# Altium schematic sheet MCU.SchDoc: MCU
size A
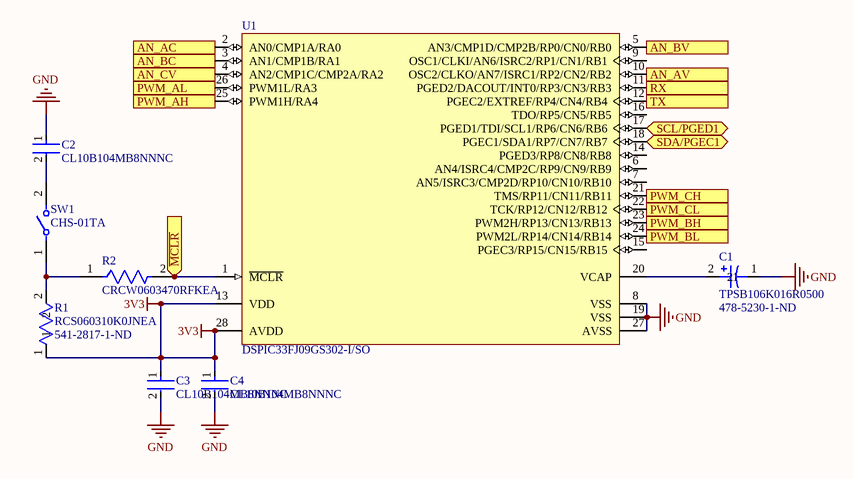
[diagram p0: MCU.SchDoc]

## Parts
C1  TPSB106K016R0500  Supplier Part Number 1: 478-5230-1-ND  [TPSB106K016R0500]
C2  CL10B104MB8NNNC  [FP-CL10-IPC_C]
C3  CL10B104MB8NNNC  [FP-CL10-IPC_C]
C4  CL10B104MB8NNNC  [FP-CL10-IPC_C]
R1  RCS060310K0JNEA  Supplier Part Number 1: 541-2817-1-ND  [RCS060310K0JNEA]
R2  CRCW0603470RFKEA  [FP-CRCW0603-e3-MFG]
SW1  CHS-01TA  [FP-CHS-01TA-MFG]
U1  DSPIC33FJ09GS302-I/SO  [MCHP-SOIC-SO28_M]

## Ports
AN_AC (in), AN_AV (in), AN_BC (in), AN_BV (in), AN_CV (in), PWM_AH (out), PWM_AL (out), PWM_BH (out), PWM_BL (out), PWM_CH (out), PWM_CL (out), RX (in), SCL/PGED1 (bidir), SDA/PGEC1 (bidir), TX (out), ~{MCLR} (in)

## Nets
3V3: C3.1 C4.1 R1.1 U1.13(VDD) U1.28(AVDD)
GND: C1.1 C2.1 C3.2 C4.2 U1.8(VSS) U1.19(VSS) U1.27(AVSS)
AN_AC: U1.2(AN0/CMP1A/RA0) ; port AN_AC
AN_AV: U1.10(OSC2/CLKO/AN7/ISRC1/RP2/CN2/RB2) ; port AN_AV
AN_BC: U1.3(AN1/CMP1B/RA1) ; port AN_BC
AN_BV: U1.5(AN3/CMP1D/CMP2B/RP0/CN0/RB0) ; port AN_BV
AN_CV: U1.4(AN2/CMP1C/CMP2A/RA2) ; port AN_CV
~{MCLR}: R2.2 U1.1(~{MCLR}) ; port ~{MCLR}
PWM_AH: U1.25(PWM1H/RA4) ; port PWM_AH
PWM_AL: U1.26(PWM1L/RA3) ; port PWM_AL
PWM_BH: U1.23(PWM2H/RP13/CN13/RB13) ; port PWM_BH
PWM_BL: U1.24(PWM2L/RP14/CN14/RB14) ; port PWM_BL
PWM_CH: U1.21(TMS/RP11/CN11/RB11) ; port PWM_CH
PWM_CL: U1.22(TCK/RP12/CN12/RB12) ; port PWM_CL
RX: U1.11(PGED2/DACOUT/INT0/RP3/CN3/RB3) ; port RX
SCL/PGED1: U1.17(PGED1/TDI/SCL1/RP6/CN6/RB6) ; port SCL/PGED1
SDA/PGEC1: U1.18(PGEC1/SDA1/RP7/CN7/RB7) ; port SDA/PGEC1
TX: U1.12(PGEC2/EXTREF/RP4/CN4/RB4) ; port TX
NetC1_2: C1.2 U1.20(VCAP)
NetC2_2: C2.2 SW1.2
NetR1_2: R1.2 R2.1 SW1.1

Not connected (* = marked no-connect by the designer): U1 6(AN4/ISRC4/CMP2C/RP9/CN9/RB9) 7(AN5/ISRC3/CMP2D/RP10/CN10/RB10) 9(OSC1/CLKI/AN6/ISRC2/RP1/CN1/RB1) 14(PGED3/RP8/CN8/RB8) 15(PGEC3/RP15/CN15/RB15) 16(TDO/RP5/CN5/RB5)

## Notes on the sheet
- Title
- Size:
- Date:
- A
- Number:
- Time:
- Revision:
- Sheet
- of
- File:

## Library data of the parts
C1 = TPSB106K016R0500: CAP TANT 10UF 10% 16V SMD; Manufacturer: Kyocera AVX; Dielectric Material: Tantalum; ESR (Equivalent Series Resistance): 500mR; Leakage Current: 1.6uA; Polarity: Polar; Dissipation Factor: 6%; Supplier 1: Digi-Key; Manufacturer Part Number: TPSB106K016R0500; RoHS: Yes; Category: Tantalum Capacitors; Stock 1: 4; Pricing 1: 1=0.45000, 10=0.31900, 50=0.24140, 100=0.21030, 500=0.15580, 1000=0.13243 (USD); Mount: Surface Mount,PCB; Case/Package: 1210; Case Code (Metric): 3528; Case Code (Imperial): 1210; Min Operating Temperature: -55°C; Max Operating Temperature: 125°C; Capacitance: 10uF; Tolerance: 10%; Packaging: Tape and Reel; Package Quantity: 1; Voltage Rating: 16V; Voltage Rating (DC): 16V; Features: General Purpose; Termination: SMD/SMT; Voltage: 16V; Length: 3.5mm; Width: 0.11inch; Height: 1.9mm; Depth: 2.8mm; Height - Seated (Max): 0.083inch; Radiation Hardening: No; REACH SVHC: No SVHC; Lead Free: Lead Free; ComponentLink1URL: https://datasheet.ciiva.com/11793/0900766b80e0c35e-11793349.pdf?src-supplier=RSComponents; ComponentLink1Description: https://datasheet.ciiva.com/11793/0900766b80e0c35e-11793349.pdf?src-supplier=RSComponents; ComponentLink2URL: https://datasheet.ciiva.com/264/tps-264229.pdf?src-supplier=Digi-Key; ComponentLink2Description: https://datasheet.ciiva.com/264/tps-264229.pdf?src-supplier=Digi-Key; ComponentLink3URL: https://datasheet.ciiva.com/7730/1441576-7730869.pdf?src-supplier=Element14; ComponentLink3Description: https://datasheet.ciiva.com/7730/1441576-7730869.pdf?src-supplier=Element14; ComponentLink4URL: https://datasheet.ciiva.com/17339/tps-17339429.pdf?src-supplier=Avnet+Europe; ComponentLink4Description: https://datasheet.ciiva.com/17339/tps-17339429.pdf?src-supplier=Avnet+Europe; ComponentLink5URL: https://datasheet.ciiva.com/264/tps-264230.pdf?src-supplier=Digi-Key; ComponentLink5Description: https://datasheet.ciiva.com/264/tps-264230.pdf?src-supplier=Digi-Key; ComponentLink6URL: https://datasheet.ciiva.com/7730/1680477-7730870.pdf?src-supplier=Element14; ComponentLink6Description: https://datasheet.ciiva.com/7730/1680477-7730870.pdf?src-supplier=Element14; ComponentLink7URL: https://datasheet.ciiva.com/16500/tps-16500230.pdf?src-supplier=Future+Electronics; ComponentLink7Description: https://datasheet.ciiva.com/16500/tps-16500230.pdf?src-supplier=Future+Electronics; ComponentLink8URL: https://datasheet.ciiva.com/264/tps-264231.pdf?src-supplier=Digi-Key; ComponentLink8Description: https://datasheet.ciiva.com/264/tps-264231.pdf?src-supplier=Digi-Key; ComponentLink9URL: https://datasheet.ciiva.com/7730/1441576-7730871.pdf?src-supplier=Element14; ComponentLink9Description: https://datasheet.ciiva.com/7730/1441576-7730871.pdf?src-supplier=Element14; ComponentLink10URL: https://datasheet.ciiva.com/12882/tps-23028-12882919.pdf?src-supplier=Mouser; ComponentLink10Description: https://datasheet.ciiva.com/12882/tps-23028-12882919.pdf?src-supplier=Mouser; ComponentLink11URL: https://datasheet.ciiva.com/28609/packmark-28609112.pdf?src-supplier=Element14; ComponentLink11Description: https://datasheet.ciiva.com/28609/packmark-28609112.pdf?src-supplier=Element14; ComponentLink12URL: https://datasheet.ciiva.com/14599/70001047-14599898.pdf?src-supplier=Allied+Electronics; ComponentLink12Description: https://datasheet.ciiva.com/14599/70001047-14599898.pdf?src-supplier=Allied+Electronics; ComponentLink13URL: https://datasheet.ciiva.com/14605/70001047-14605902.pdf?src-supplier=Allied+Electronics; ComponentLink13Description: https://datasheet.ciiva.com/14605/70001047-14605902.pdf?src-supplier=Allied+Electronics
C2-C4 = CMP-13271-001724-1: Cap Ceramic 100nF 50V X7R ±20% Pad SMD 0603 +125°C T/R; Mount: Surface Mount; Lead Free: Lead Free; Max Operating Temperature: 125°C; Voltage Rating: 50V; Case Code (Imperial): 0603; Capacitance: 100nF; Height: 0.8mm; Length: 1.6mm; Tolerance: 20%; Case Code (Metric): 1608; Thickness: 0.035inch; Depth: 0.8mm; Width: 0.031inch; Package Quantity: 1; Min Operating Temperature: -55°C; Case/Package: 0603; Radiation Hardening: No; Voltage Rating (DC): 50V; Dielectric: X7R; Packaging: Tape and Reel
R1 = RCS060310K0JNEA: RES SMD 10K OHM 5% 1/4W 0603; Manufacturer: Vishay Dale; Max Power Dissipation: 250mW; Temperature Coefficient: 200ppm/°C; Resistance: 10kR; Supplier 1: Digi-Key; Manufacturer Part Number: RCS060310K0JNEA; RoHS: Yes; Category: Chip SMD Resistors; Stock 1: 1896; Pricing 1: 1=0.14000, 10=0.12900, 100=0.04950, 1000=0.02178, 2500=0.01881 (USD); Case/Package: 0603; Case Code (Imperial): 0603; Case Code (Metric): 1608; Min Operating Temperature: -55°C; Max Operating Temperature: 155°C; Tolerance: 5%; Features: Automotive AEC-Q200; Packaging: Tape and Reel; Resistor Type: Thick Film; Number of Terminations: 2; Length: 0.061inch; Width: 0.033inch; Height: 0.02inch; ComponentLink1URL: http://www.vishay.com/docs/20065/rcse3.pdf?src-supplier=Digi-Key; ComponentLink1Description: http://www.vishay.com/docs/20065/rcse3.pdf?src-supplier=Digi-Key
R2 = CMP-2000-03373-2: RES Thick Film, 470Ω, 1%, 0.1W, 100ppm/°C, 0603; Voltage Rating: 75V; Resistance: 470R; Max Power Dissipation: 100mW; Lead Free: Lead Free; Weight: 7.1E-05oz; Composition: Thick Film; Case Code (Imperial): 0603; Height: 0.45mm; Width: 0.033inch; Case/Package: 0603; Package Quantity: 10; Temperature Coefficient: 100ppm/°C; Min Operating Temperature: -55°C; Case Code (Metric): 1608; Radiation Hardening: No; Mount: Surface Mount; Tolerance: 1%; Depth: 0.85mm; Power Rating: 100mW; Length: 1.55mm; Voltage Rating (DC): 75V; Number of Terminations: 2; Contact Plating: Tin; Packaging: Tape and Reel; Termination: SMD/SMT; Features: Automotive AEC-Q200; Max Operating Temperature: 155°C; Military Standard: Not
SW1 = CMP-71740-000003-1: SWITCH SLIDE DIP SPST 100MA 6V; Manufacturer: Nidec Copal Electronics; Contact Resistance: 50mΩ; Standoff Height: 0mm; Number Of Circuits: 1; Electromechanical Life: 2000Cycles; Device Class L1: Electromechanical; Device Class L2: Switches; Category: Switch; Temperature Range Low: -40°C; Device Class L3: DIP Switches; Height: 2.5mm; Lead Free: Yes; Octopart: https://octopart.com/chs-01ta-nidec+copal-52304644; Throw Configuration: SPST; Package: CHS-01TA; Voltage Rating Dc: 6V; Digikey Description: SWITCH SLIDE DIP SPST 100MA 6V; Mount: Surface Mount; Automotive: No; Contact Current Rating: 100mA; ComponentLink2URL: https://www.nidec-copal-electronics.com/e/catalog/switch/chs.pdf; ComponentLink2Description: Datasheet; Temperature: -40°C to +85°C; Temperature Range High: +85°C; RoHS: TRUE; Manufacturer Part Number: CHS-01TA
U1 = CMP-0045-00654-1: 16-Bit Microcontroller and Digital Signal Controller with High-Speed PWM, ADC and Comparator, 40 MIPS, 21 I/O, GPIO, -40 to 85 degC, 28-pin SOIC (SO28), Tube; Manufacturer: Microchip; ComponentLink4URL: http://www.microchip.com/dsPIC33FJ09GS302; PackageVersion: C04-052C; DatasheetVersion: Rev. C; ComponentLink3Description: Package Specification; ComponentLink3URL: http://www.microchip.com/stellent/groups/techpub_sg/documents/packagingspec/en012702.pdf; ComponentLink1URL: http://www.microchip.com; PartNumber: DSPIC33FJ09GS302-I/SO; PackageDescription: 28-Lead Plastic Small Outline, 17.9 x 7.5 mm Body, 1.27 mm Pitch; Mounting Technology: Surface Mount; PackageReference: SOIC-SO28; ComponentLink2URL: http://ww1.microchip.com/downloads/en/DeviceDoc/75018c.pdf; ComponentLink1Description: Manufacturer URL; ComponentLink2Description: Datasheet; ComponentLink4Description: Product URL